# EasyEDA schematic SCH_StairLights_2024-01-15.json

## Sheets
1 StairLightsDigital: TITLE: Sheet_1; REV: 1.0; Date: 2022-04-26; Sheet: 1/1; Drawn By: budij; Company: Your Company
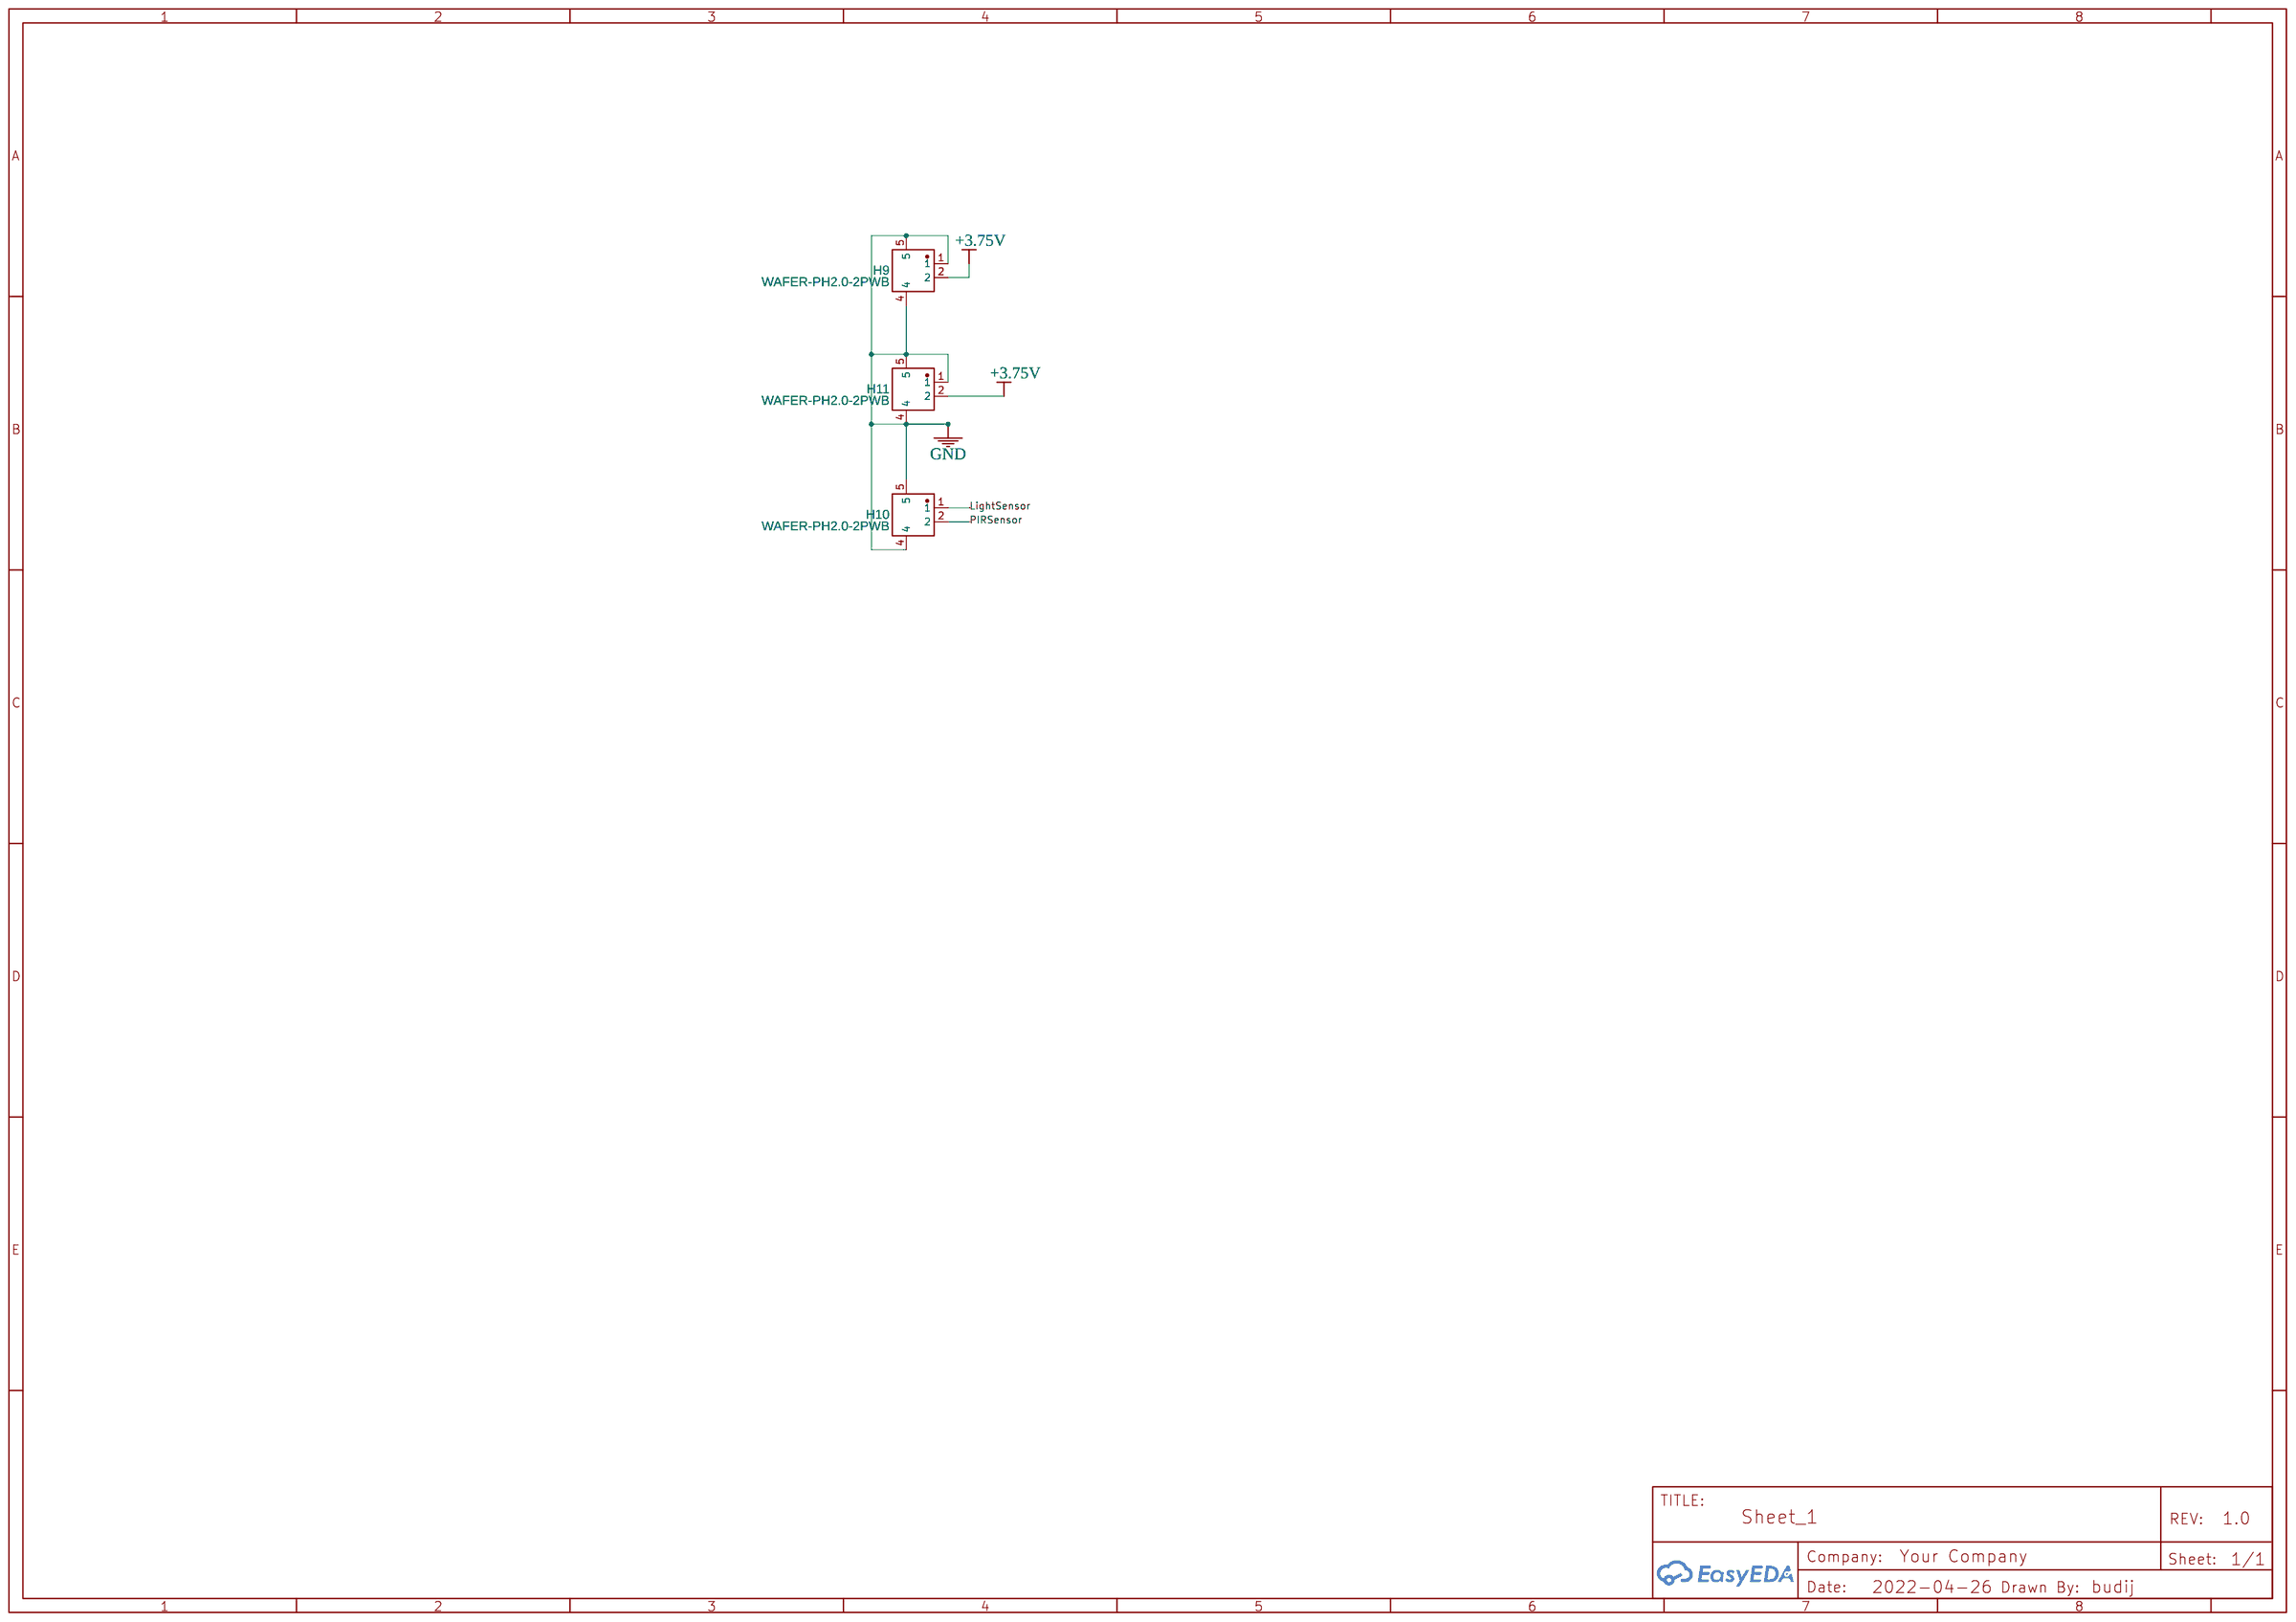
[diagram p0: StairLightsDigital]
2 PowerModule
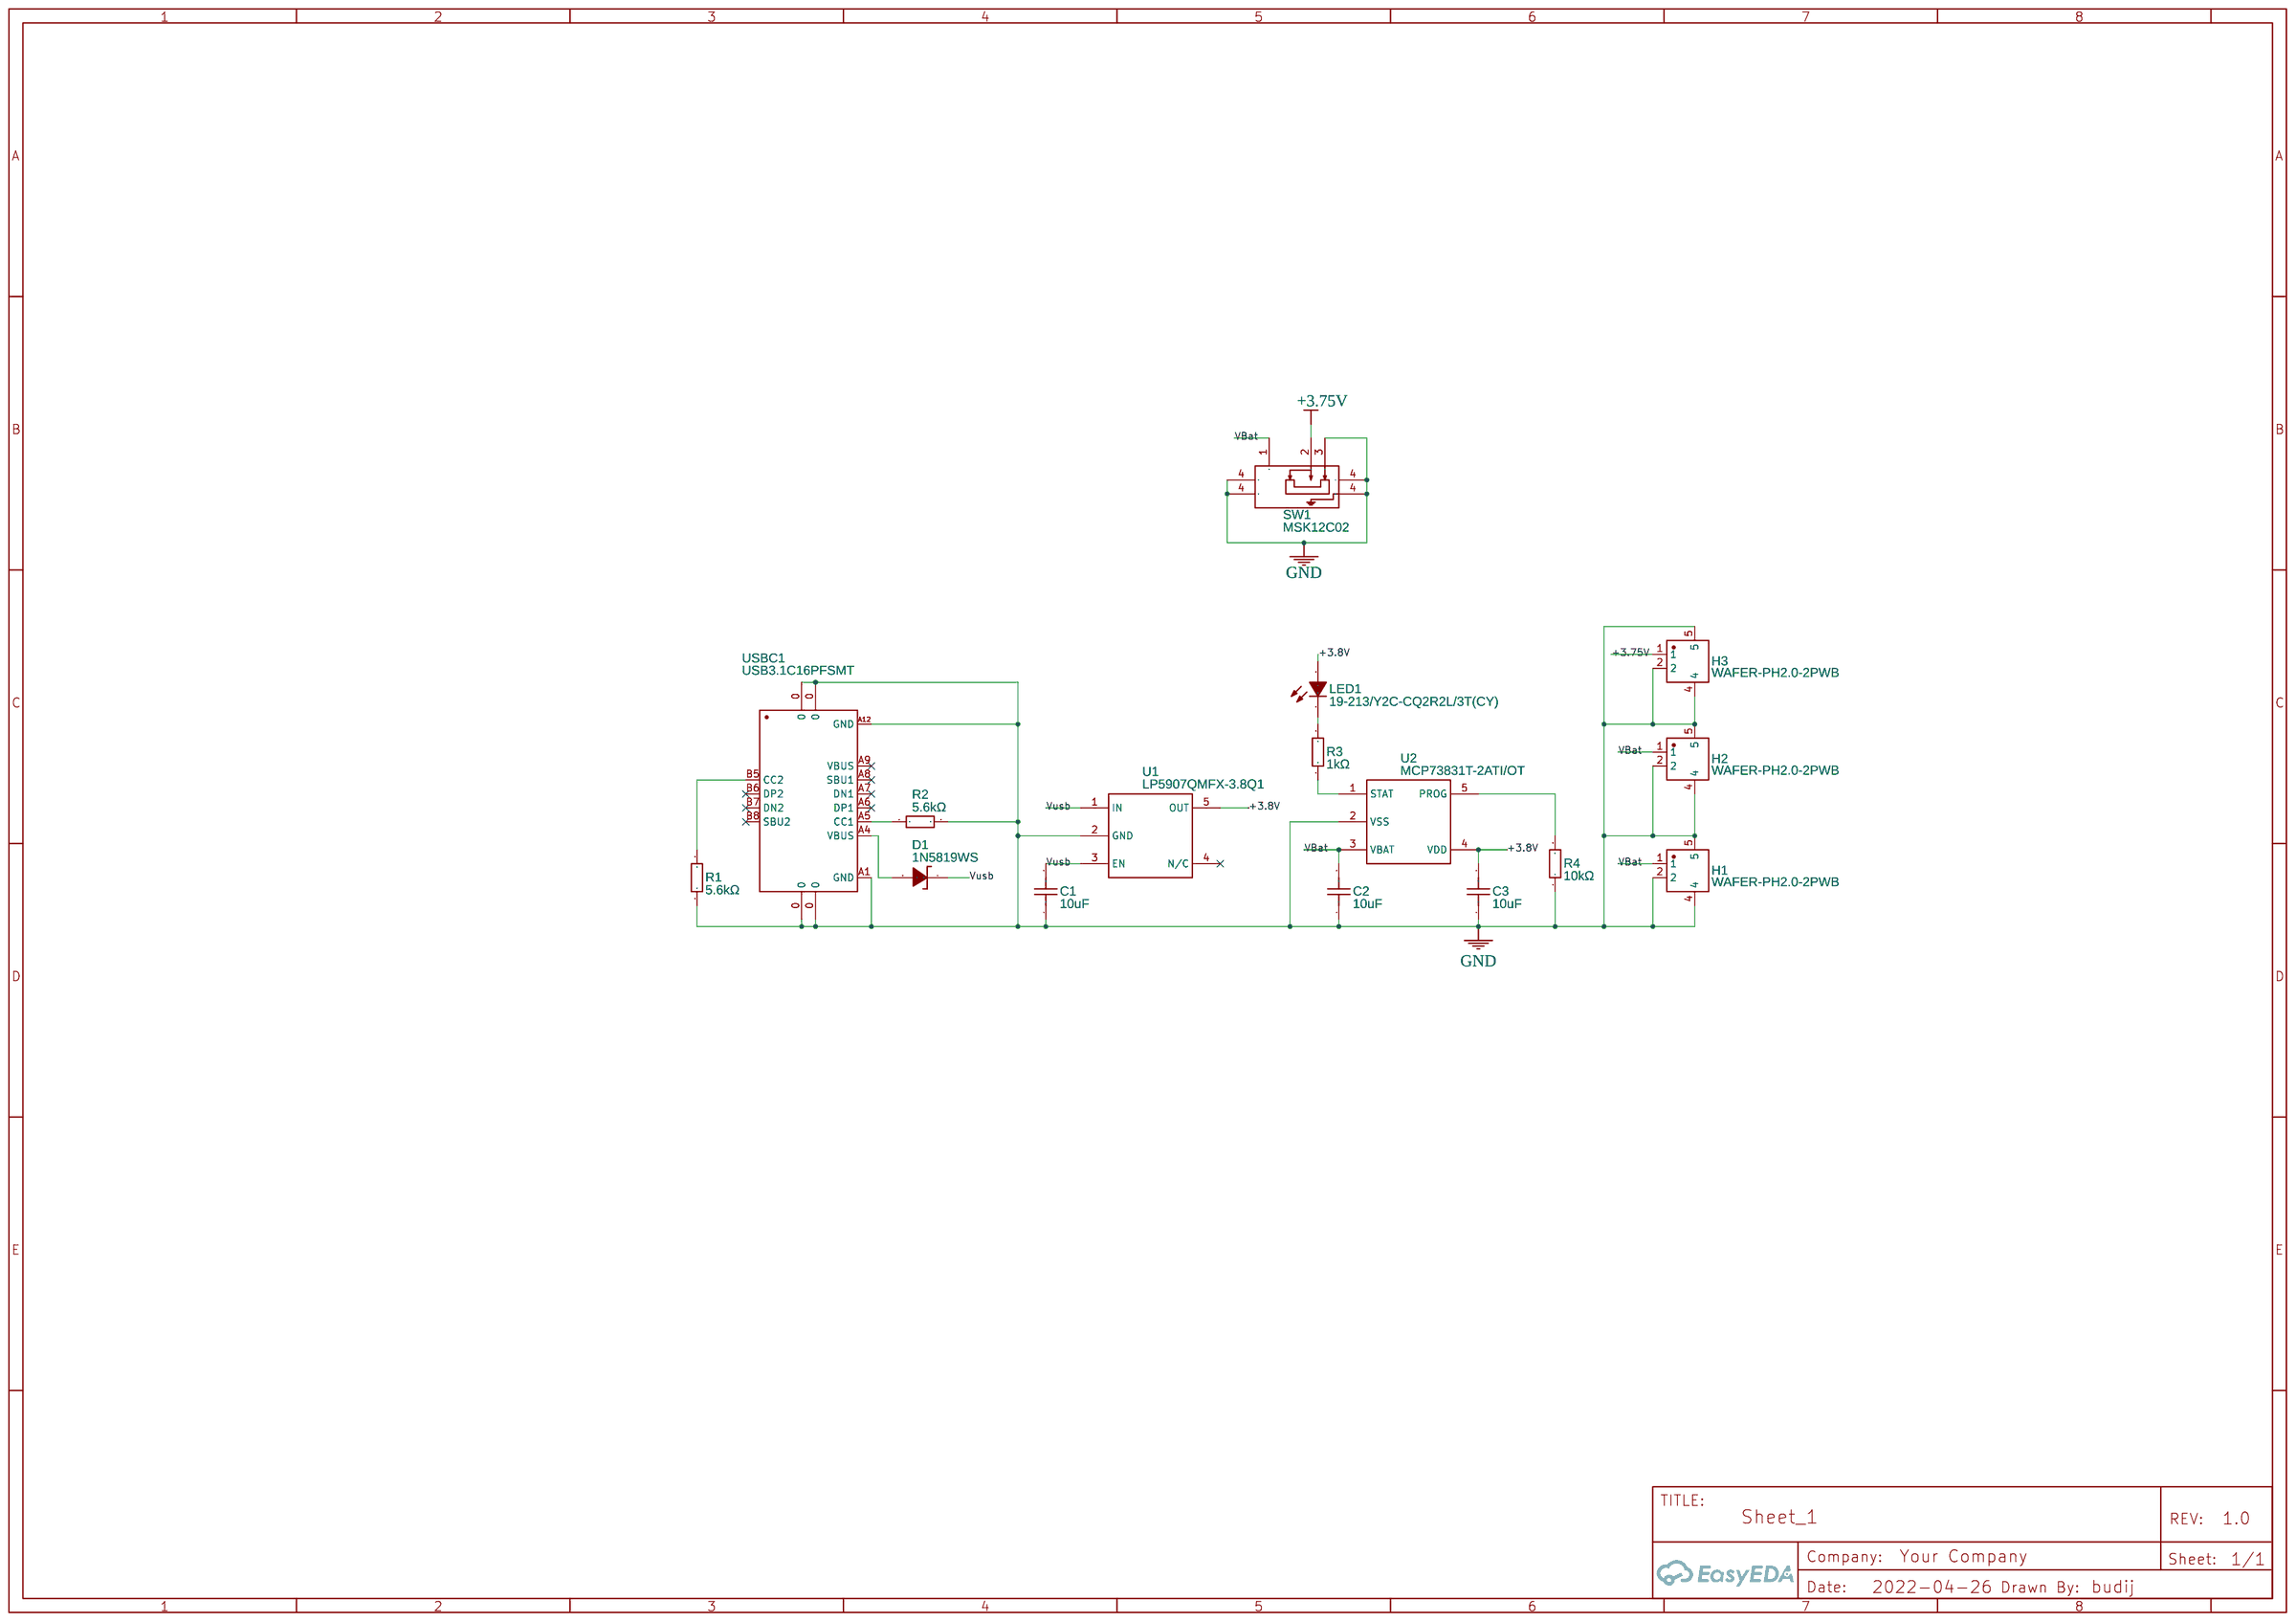
[diagram p1: PowerModule]
3 StairLightsAnalog
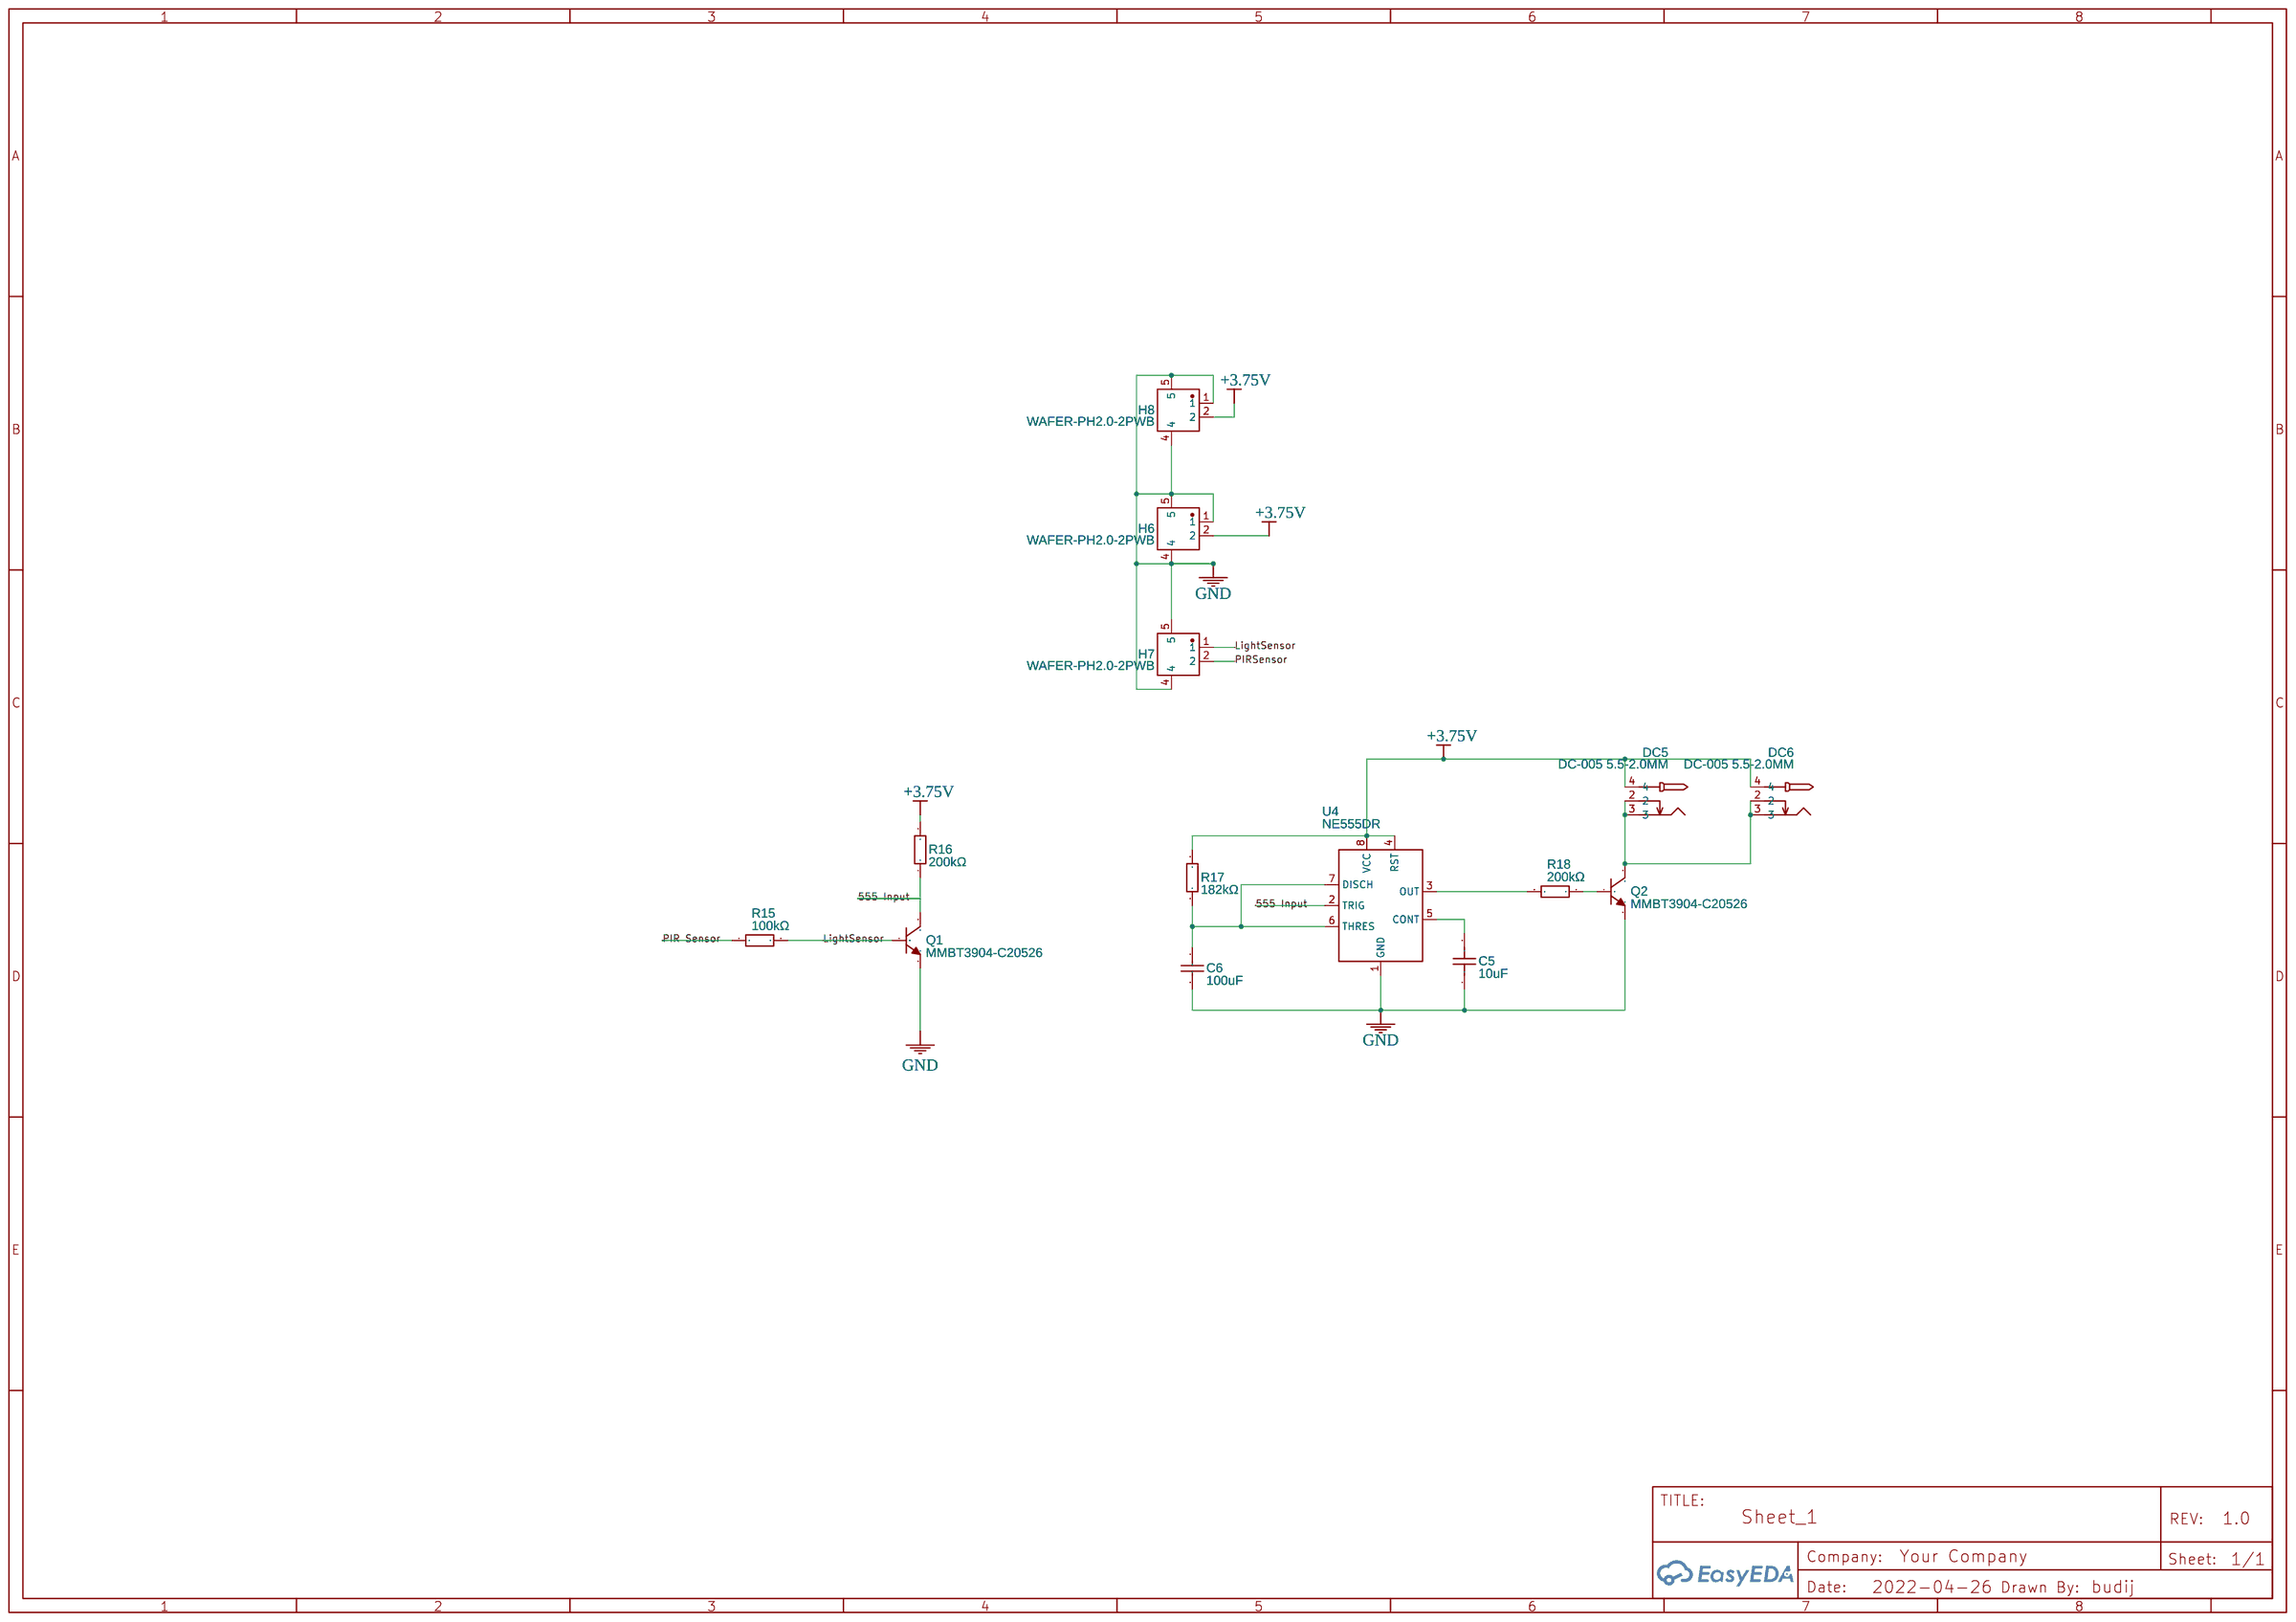
[diagram p2: StairLightsAnalog]
4 LightsModule
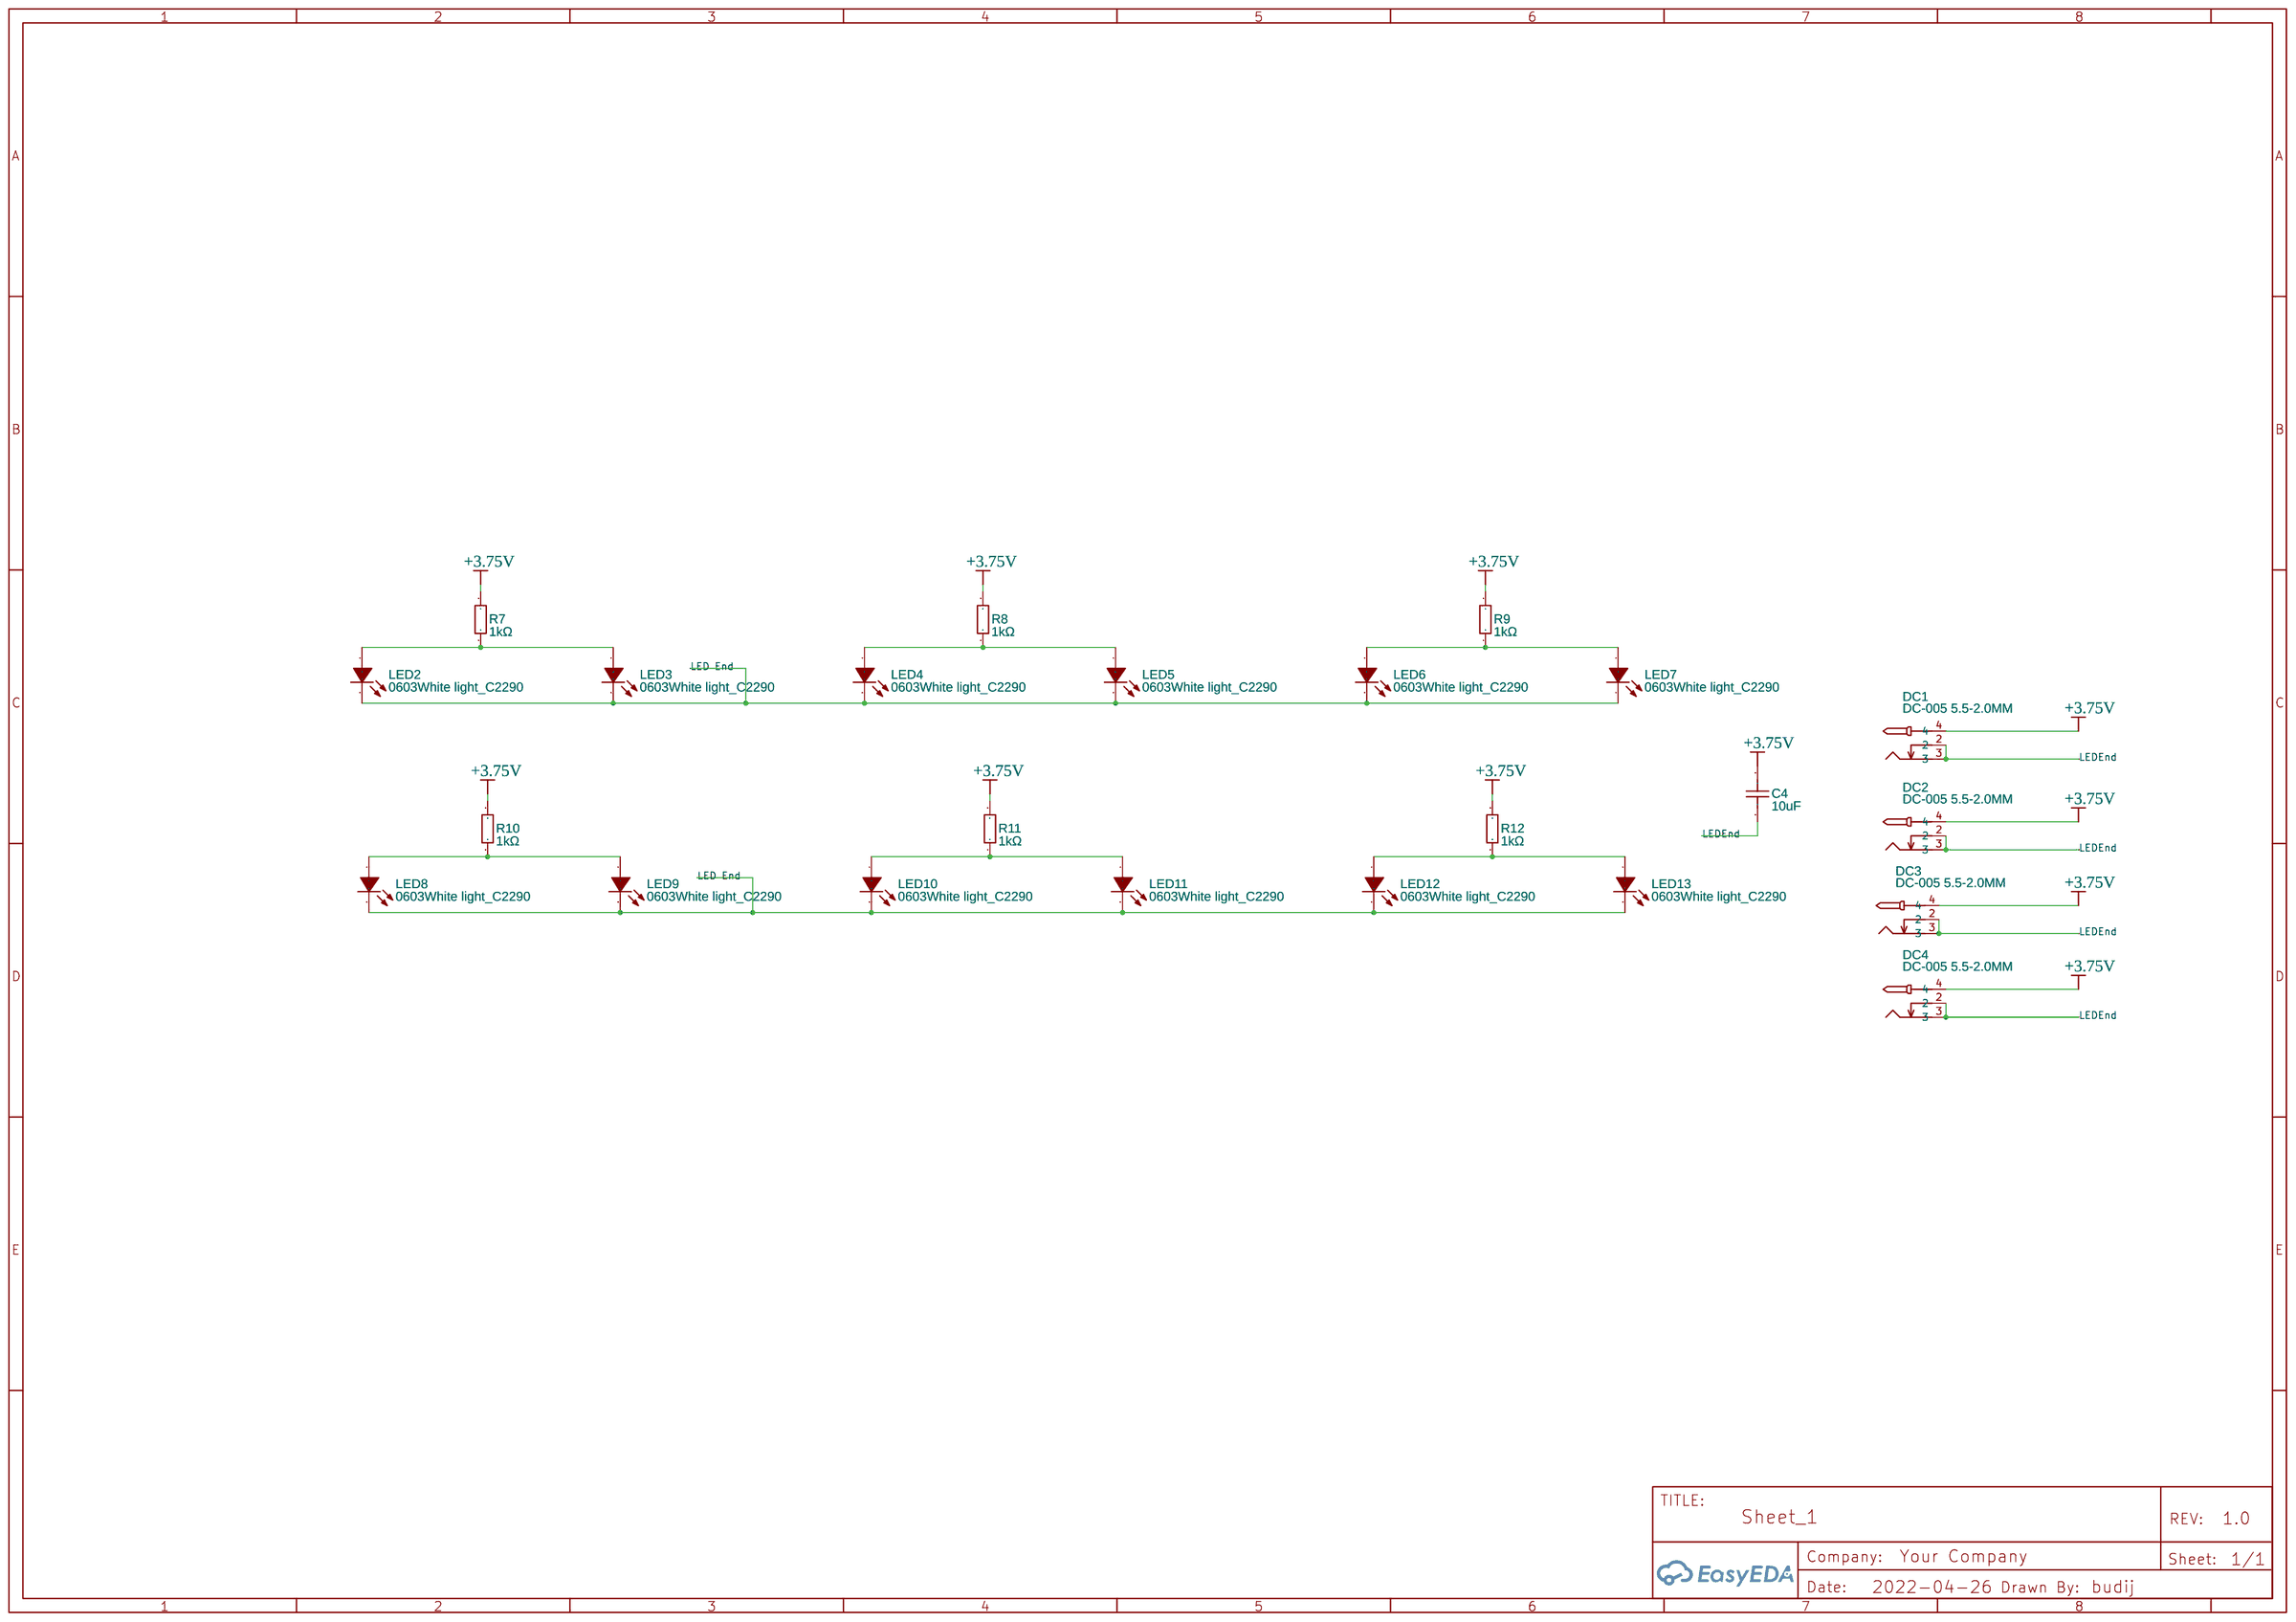
[diagram p3: LightsModule]
5 SensorModule
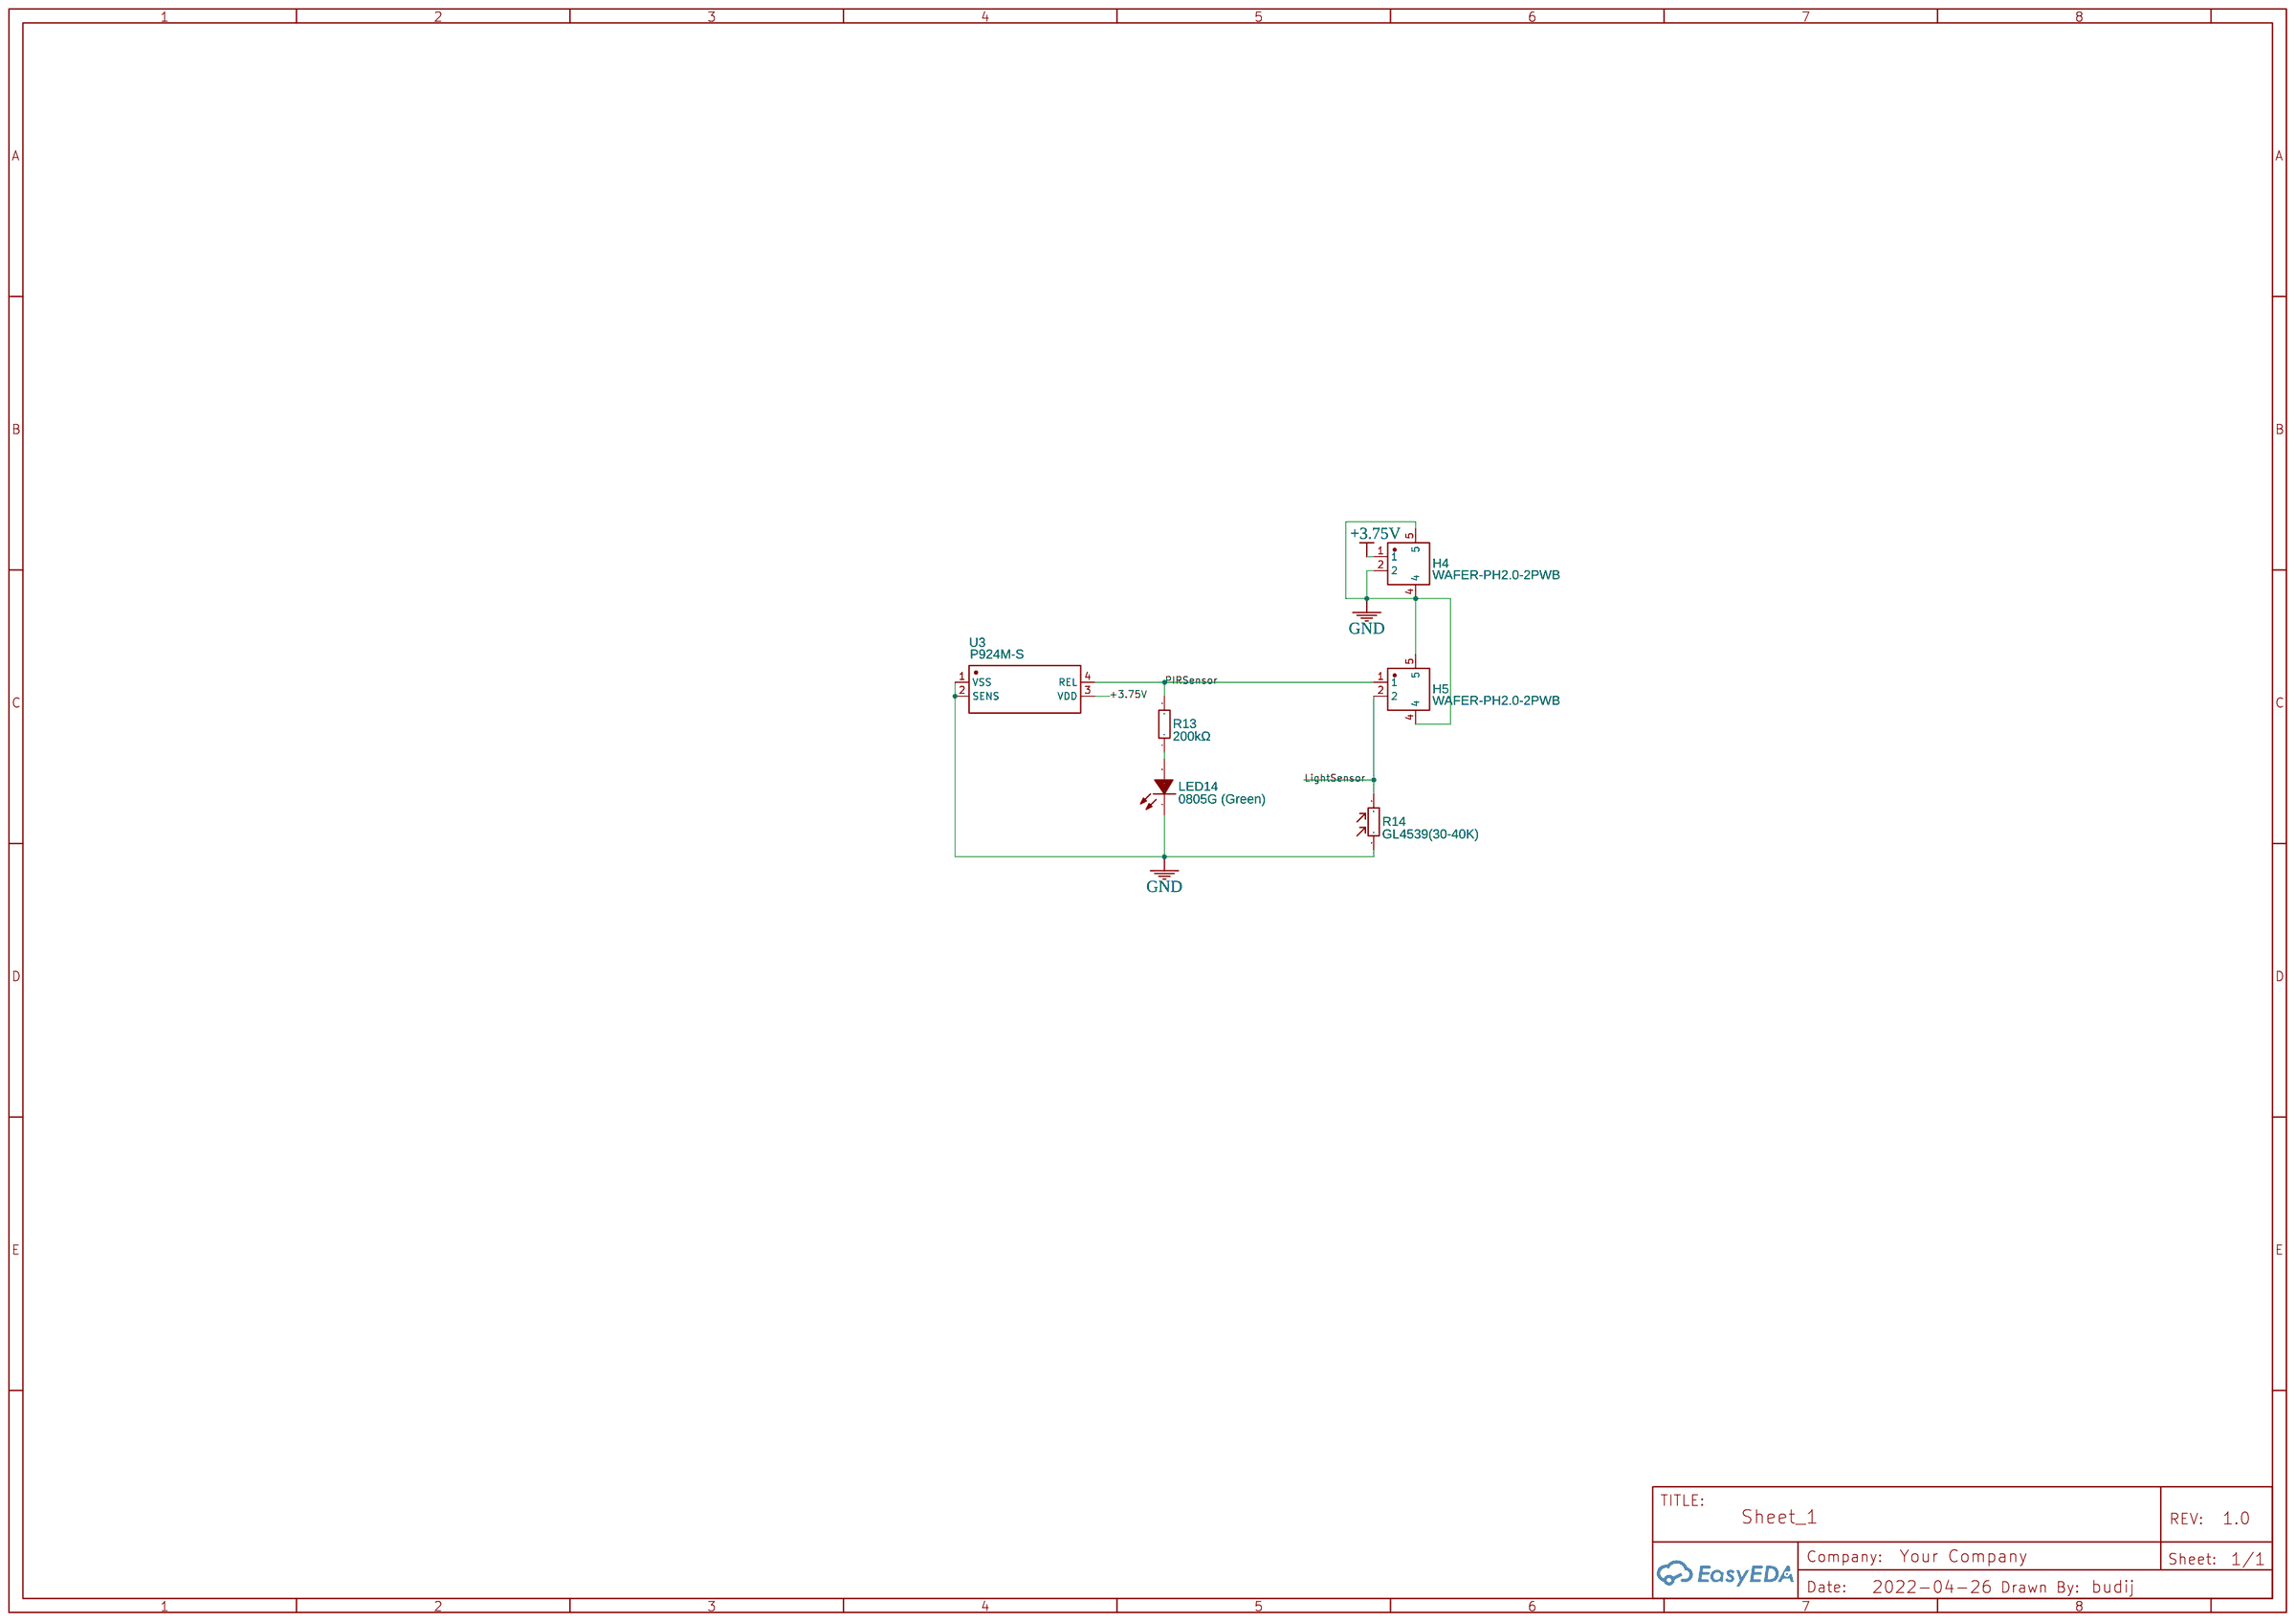
[diagram p4: SensorModule]

## Parts
sheet LightsModule
C4  10uF  [C0603]
DC1  DC-005 5.5-2.0MM  [DC-IN-TH_DC-5520-1]
DC2  DC-005 5.5-2.0MM  [DC-IN-TH_DC-5520-1]
DC3  DC-005 5.5-2.0MM  [DC-IN-TH_DC-5520-1]
DC4  DC-005 5.5-2.0MM  [DC-IN-TH_DC-5520-1]
LED2  0603White light_C2290  [LED0603-R-RD_WHITE]
LED3  0603White light_C2290  [LED0603-R-RD_WHITE]
LED4  0603White light_C2290  [LED0603-R-RD_WHITE]
LED5  0603White light_C2290  [LED0603-R-RD_WHITE]
LED6  0603White light_C2290  [LED0603-R-RD_WHITE]
LED7  0603White light_C2290  [LED0603-R-RD_WHITE]
LED8  0603White light_C2290  [LED0603-R-RD_WHITE]
LED9  0603White light_C2290  [LED0603-R-RD_WHITE]
LED10  0603White light_C2290  [LED0603-R-RD_WHITE]
LED11  0603White light_C2290  [LED0603-R-RD_WHITE]
LED12  0603White light_C2290  [LED0603-R-RD_WHITE]
LED13  0603White light_C2290  [LED0603-R-RD_WHITE]
R7  1kΩ  [R0603]
R8  1kΩ  [R0603]
R9  1kΩ  [R0603]
R10  1kΩ  [R0603]
R11  1kΩ  [R0603]
R12  1kΩ  [R0603]
sheet PowerModule
C1  10uF  [C0603]
C2  10uF  [C0603]
C3  10uF  [C0603]
D1  1N5819WS  [SOD-323_L1.8-W1.3-LS2.5-RD]
H1  WAFER-PH2.0-2PWB  [CONN-SMD_2P-P2.00_XUNPU_WAFER-PH2.0-2PWB]
H2  WAFER-PH2.0-2PWB  [CONN-SMD_2P-P2.00_XUNPU_WAFER-PH2.0-2PWB]
H3  WAFER-PH2.0-2PWB  [CONN-SMD_2P-P2.00_XUNPU_WAFER-PH2.0-2PWB]
LED1  19-213/Y2C-CQ2R2L/3T(CY)  [LED0603-RD-YELLOW]
R1  5.6kΩ  [R0603]
R2  5.6kΩ  [R0603]
R3  1kΩ  [R0603]
R4  10kΩ  [R0603]
SW1  MSK12C02  [SW-TH_MSK12C02]
U1  LP5907QMFX-3.8Q1  [SOT-23-5_L3.0-W1.7-P0.95-LS2.8-BL]
U2  MCP73831T-2ATI/OT  [SOT-23-5_L3.0-W1.7-P0.95-LS2.8-BR]
USBC1  USB3.1C16PFSMT  [USB-C-SMD_TYPE-C-USB-17]
sheet SensorModule
H4  WAFER-PH2.0-2PWB  [CONN-SMD_2P-P2.00_XUNPU_WAFER-PH2.0-2PWB]
H5  WAFER-PH2.0-2PWB  [CONN-SMD_2P-P2.00_XUNPU_WAFER-PH2.0-2PWB]
LED14  0805G (Green)  [LED0805-RD_GREEN]
R13  200kΩ  [R0603]
R14  GL4539(30-40K)  [RES-TH_L4.1-W3.4-P2.50_GL45]
U3  P924M-S  [PIR-TH_P924M-S]
sheet StairLightsAnalog
C5  10uF  [C0603]
C6  100uF  [C1206]
DC5  DC-005 5.5-2.0MM  [DC-IN-TH_DC-5520-1]
DC6  DC-005 5.5-2.0MM  [DC-IN-TH_DC-5520-1]
H6  WAFER-PH2.0-2PWB  [CONN-SMD_2P-P2.00_XUNPU_WAFER-PH2.0-2PWB]
H7  WAFER-PH2.0-2PWB  [CONN-SMD_2P-P2.00_XUNPU_WAFER-PH2.0-2PWB]
H8  WAFER-PH2.0-2PWB  [CONN-SMD_2P-P2.00_XUNPU_WAFER-PH2.0-2PWB]
Q1  MMBT3904-C20526  [SOT-23-3_L2.9-W1.3-P1.90-LS2.4-BR]
Q2  MMBT3904-C20526  [SOT-23-3_L2.9-W1.3-P1.90-LS2.4-BR]
R15  100kΩ  [R0603]
R16  200kΩ  [R0603]
R17  182kΩ  [R0603]
R18  200kΩ  [R0603]
U4  NE555DR  [SOIC-8_L4.9-W3.9-P1.27-LS6.0-BL]
sheet StairLightsDigital
H9  WAFER-PH2.0-2PWB  [CONN-SMD_2P-P2.00_XUNPU_WAFER-PH2.0-2PWB]
H10  WAFER-PH2.0-2PWB  [CONN-SMD_2P-P2.00_XUNPU_WAFER-PH2.0-2PWB]
H11  WAFER-PH2.0-2PWB  [CONN-SMD_2P-P2.00_XUNPU_WAFER-PH2.0-2PWB]

## Library data of the parts
C1-C5 = CL10A106KP8NNNC: Supplier: LCSC; Manufacturer: SAMSUNG(三星); Supplier Part: C19702; JLCPCB Part Class: Basic Part
DC1-DC6 = DC-005 5.5-2.0MM: Supplier: LCSC; Manufacturer: BOOMELE(博穆精密); Manufacturer Part: DC-005 2.0; Supplier Part: C16214; JLCPCB Part Class: Extended Part; link: https://lcsc.com/eda_search?q=C16214&%26type=1&ref=editor
LED2-LED13 = 0603White light_C2290: Supplier: LCSC; Manufacturer: null; Manufacturer Part: KT-0603白灯; Supplier Part: C2290; JLCPCB Part Class: Basic Part
R3 R7-R12 = 0603WAF1001T5E: Supplier: LCSC; Manufacturer: UNI-ROYAL(厚声); Supplier Part: C21190; Resistance (Ohms): 1K; JLCPCB Part Class: Basic Part
D1 = 1N5819WS: Supplier: LCSC; Supplier Part: C191023; Manufacturer: Hottech(合科泰); Contributor: LCSC; JLCPCB Part Class: Basic Part
H1-H11 = WAFER-PH2.0-2PWB: Supplier: LCSC; Supplier Part: C3029440; Manufacturer: XUNPU(讯普); link: https://atta.szlcsc.com/upload/public/pdf/source/20220527/83903C18429EFE4C9EEE8C529A248431.pdf; Contributor: lcsc; JLCPCB Part Class: Extended Part
LED1 = 19-213/Y2C-CQ2R2L/3T(CY): Supplier: LCSC; Manufacturer: EVERLIGHT(亿光); Supplier Part: C72038; JLCPCB Part Class: Basic Part; link: https://lcsc.com/eda_search?q=C72038&%26type=1&ref=editor
R1 R2 = 0603WAF5601T5E: Supplier: LCSC; Manufacturer: UNI-ROYAL(厚声); Supplier Part: C23189; Resistance (Ohms): 5.6K; JLCPCB Part Class: Basic Part
R4 = 0603WAF1002T5E: Supplier: LCSC; Manufacturer: UNI-ROYAL(厚声); Supplier Part: C25804; JLCPCB Part Class: Basic Part; link: https://lcsc.com/eda_search?q=C25804&%26type=1&ref=editor
SW1 = MSK12C02: Supplier: LCSC; Supplier Part: C431540; Manufacturer: SHOU HAN(首韩); Contributor: LCSC; JLCPCB Part Class: Extended Part
U1 = LP5907QMFX-3.8Q1: Contributor: LCSC; Supplier: LCSC; Manufacturer: TI(德州仪器); Supplier Part: C132035; JLCPCB Part Class: Extended Part; link: https://lcsc.com/eda_search?q=C132035&%26type=1&ref=editor
U2 = MCP73831T-2ATI/OT: Supplier: LCSC; Manufacturer: MICROCHIP; Supplier Part: C14879; JLCPCB Part Class: Extended Part
USBC1 = USB3.1C16PFSMT: Supplier: LCSC; Supplier Part: C167321; Manufacturer: LCSC; Contributor: LCSC; JLCPCB Part Class: Extended Part
LED14 = 0805G (Green): Supplier: LCSC; Manufacturer: KENTO; Supplier Part: C2297; JLCPCB Part Class: Basic Part
R13 = 0603WAF1002T5E: Supplier: LCSC; Manufacturer: UNI-ROYAL(厚声); Supplier Part: C25811; JLCPCB Part Class: Basic Part; link: https://lcsc.com/eda_search?q=C25804&%26type=1&ref=editor
R14 = GL4539(30-40K): Supplier: LCSC; Manufacturer: ReliaPro; Supplier Part: C11295; JLCPCB Part Class: Extended Part
U3 = P924M-S: Supplier: LCSC; Manufacturer: Nicera; Contributor: LCSC; Supplier Part: C139580; LCSC Assembly: Yes; SMT Type: Extend; Paste Type: expand
C6 = CL31A107MQHNNNE: Supplier: LCSC; Manufacturer: SAMSUNG(三星); Supplier Part: C15008; JLCPCB Part Class: Basic Part; link: https://lcsc.com/eda_search?q=C15008&%26type=1&ref=editor
Q1 Q2 = MMBT3904-C20526: Contributor: 立创EDA官方封装库; Supplier: LCSC; Manufacturer: CJ(江苏长电/长晶); Manufacturer Part: MMBT3904; Supplier Part: C20526; JLCPCB Part Class: Basic Part; link: https://lcsc.com/eda_search?q=C20526&%26type=1&ref=editor
R15 = 0603WAF1003T5E: Supplier: LCSC; Manufacturer: UNI-ROYAL(厚声); Supplier Part: C25803; Resistance (Ohms): 100K; JLCPCB Part Class: Basic Part
R16 R18 = 0603WAF2003T5E: Supplier: LCSC; Manufacturer: UNI-ROYAL(厚声); Supplier Part: C25811; Resistance (Ohms): 200K; JLCPCB Part Class: Basic Part
R17 = CR0603-FX-1823ELF: Contributor: LCSC; Supplier: LCSC; Supplier Part: C203368; Manufacturer: BOURNS; JLCPCB Part Class: Extended Part; link: https://lcsc.com/eda_search?q=C203368&%26type=1&ref=editor
U4 = NE555DR: Supplier: LCSC; Manufacturer: TI; Supplier Part: C7593; JLCPCB Part Class: Basic Part

## Nets
+3.8V: C3.2 LED1.2(A) U1.5(OUT) U2.4(VDD)
+3.75V: C4.2 DC1.4 DC2.4 DC3.4 DC4.4 DC5.4 DC6.4 H3.1 H4.1 H6.2 H8.2 H9.2 H11.2 R7.2 R8.2 R9.2 R10.2 R11.2 R12.2 R16.2 R17.1 SW1.2 U3.3(VDD) U4.4(RST) U4.8(VCC)
GND: C1.1 C2.1 C3.1 C5.1 C6.1 H1.2 H1.4 H1.5 H2.2 H2.4 H2.5 H3.2 H3.4 H3.5 H4.2 H4.4 H4.5 H5.4 H5.5 H6.1 H6.4 H6.5 H7.4 H7.5 H8.1 H8.4 H8.5 H9.1 H9.4 H9.5 H10.4 H10.5 H11.1 H11.4 H11.5 LED14.1(K) Q1.2(E) Q2.2(E) R1.1 R2.2 R4.1 R14.1 SW1.3 SW1.4 U1.2(GND) U2.2(VSS) U3.1(VSS) U3.2(SENS) U4.1(GND) USBC1.0 USBC1.A1(GND) USBC1.A12(GND)
VBat: C2.2 H1.1 H2.1 SW1.1 U2.3(VBAT)
555 Input: Q1.3(C) R16.1 U4.2(TRIG)
LED End: LED2.2(K) LED3.2(K) LED4.2(K) LED5.2(K) LED6.2(K) LED7.2(K) LED8.2(K) LED9.2(K) LED10.2(K) LED11.2(K) LED12.2(K) LED13.2(K)
LEDEnd: C4.1 DC1.2 DC1.3 DC2.2 DC2.3 DC3.2 DC3.3 DC4.2 DC4.3
LightSensor: H5.2 H7.1 H10.1 Q1.1(B) R14.2 R15.2
PIR Sensor: R15.1
PIRSensor: H5.1 H7.2 H10.2 R13.2 U3.4(REL)
Vusb: C1.2 D1.1(C) U1.1(IN) U1.3(EN)
Net-(C5-2): C5.2 U4.5(CONT)
Net-(C6-2): C6.2 R17.2 U4.6(THRES) U4.7(DISCH)
Net-(D1-2): D1.2(A) USBC1.A4(VBUS)
Net-(DC5-2): DC5.2 DC5.3 DC6.2 DC6.3 Q2.3(C)
Net-(LED1-1): LED1.1(C) R3.2
Net-(LED2-1): LED2.1(A) LED3.1(A) R7.1
Net-(LED4-1): LED4.1(A) LED5.1(A) R8.1
Net-(LED6-1): LED6.1(A) LED7.1(A) R9.1
Net-(LED8-1): LED8.1(A) LED9.1(A) R10.1
Net-(LED10-1): LED10.1(A) LED11.1(A) R11.1
Net-(LED12-1): LED12.1(A) LED13.1(A) R12.1
Net-(LED14-2): LED14.2(A) R13.1
Net-(Q2-1): Q2.1(B) R18.1
Net-(R1-2): R1.2 USBC1.B5(CC2)
Net-(R2-1): R2.1 USBC1.A5(CC1)
Net-(R3-1): R3.1 U2.1(STAT)
Net-(R4-2): R4.2 U2.5(PROG)
Net-(R18-2): R18.2 U4.3(OUT)

Not connected (* = marked no-connect by the designer): U1 4(N/C)*; USBC1 A6(DP1)* A7(DN1)* A8(SBU1)* A9(VBUS)* B6(DP2)* B7(DN2)* B8(SBU2)*
